# Altium project BW1098FFC.PrjPcb (part 2 of 2)

## Sheet BW1098FFC_USB.SchDoc: =project_title
size Tabloid; PageSetup: Record=PageOptions|CenterHorizontal=True|CenterVertical=True|PrintScale=0.73|XCorrection=1.00|YCorrection=1.00|PrintKind=0|BorderSize=5000000|LeftOffset=0|BottomOffset=0|Orientation=2|PaperLength=1000|PaperWidth=1000|Scale=100|PaperSource=7|PrintQuality=-4|MediaType=1|DitherType=10|PaperKind=A4|PrintScaleMode=1; CompanyName: Luxonis Holding; DrawnBy: Brian Weinstein; Organization: Luxonis Holding; Address1: 1925 Harmony Park Drive; Address2: Westminster, CO; Address3: 80234; Address4: United States; DocumentNumber: D0000190; Revision: R2M1E2; SheetNumber: 5; SheetTotal: 5
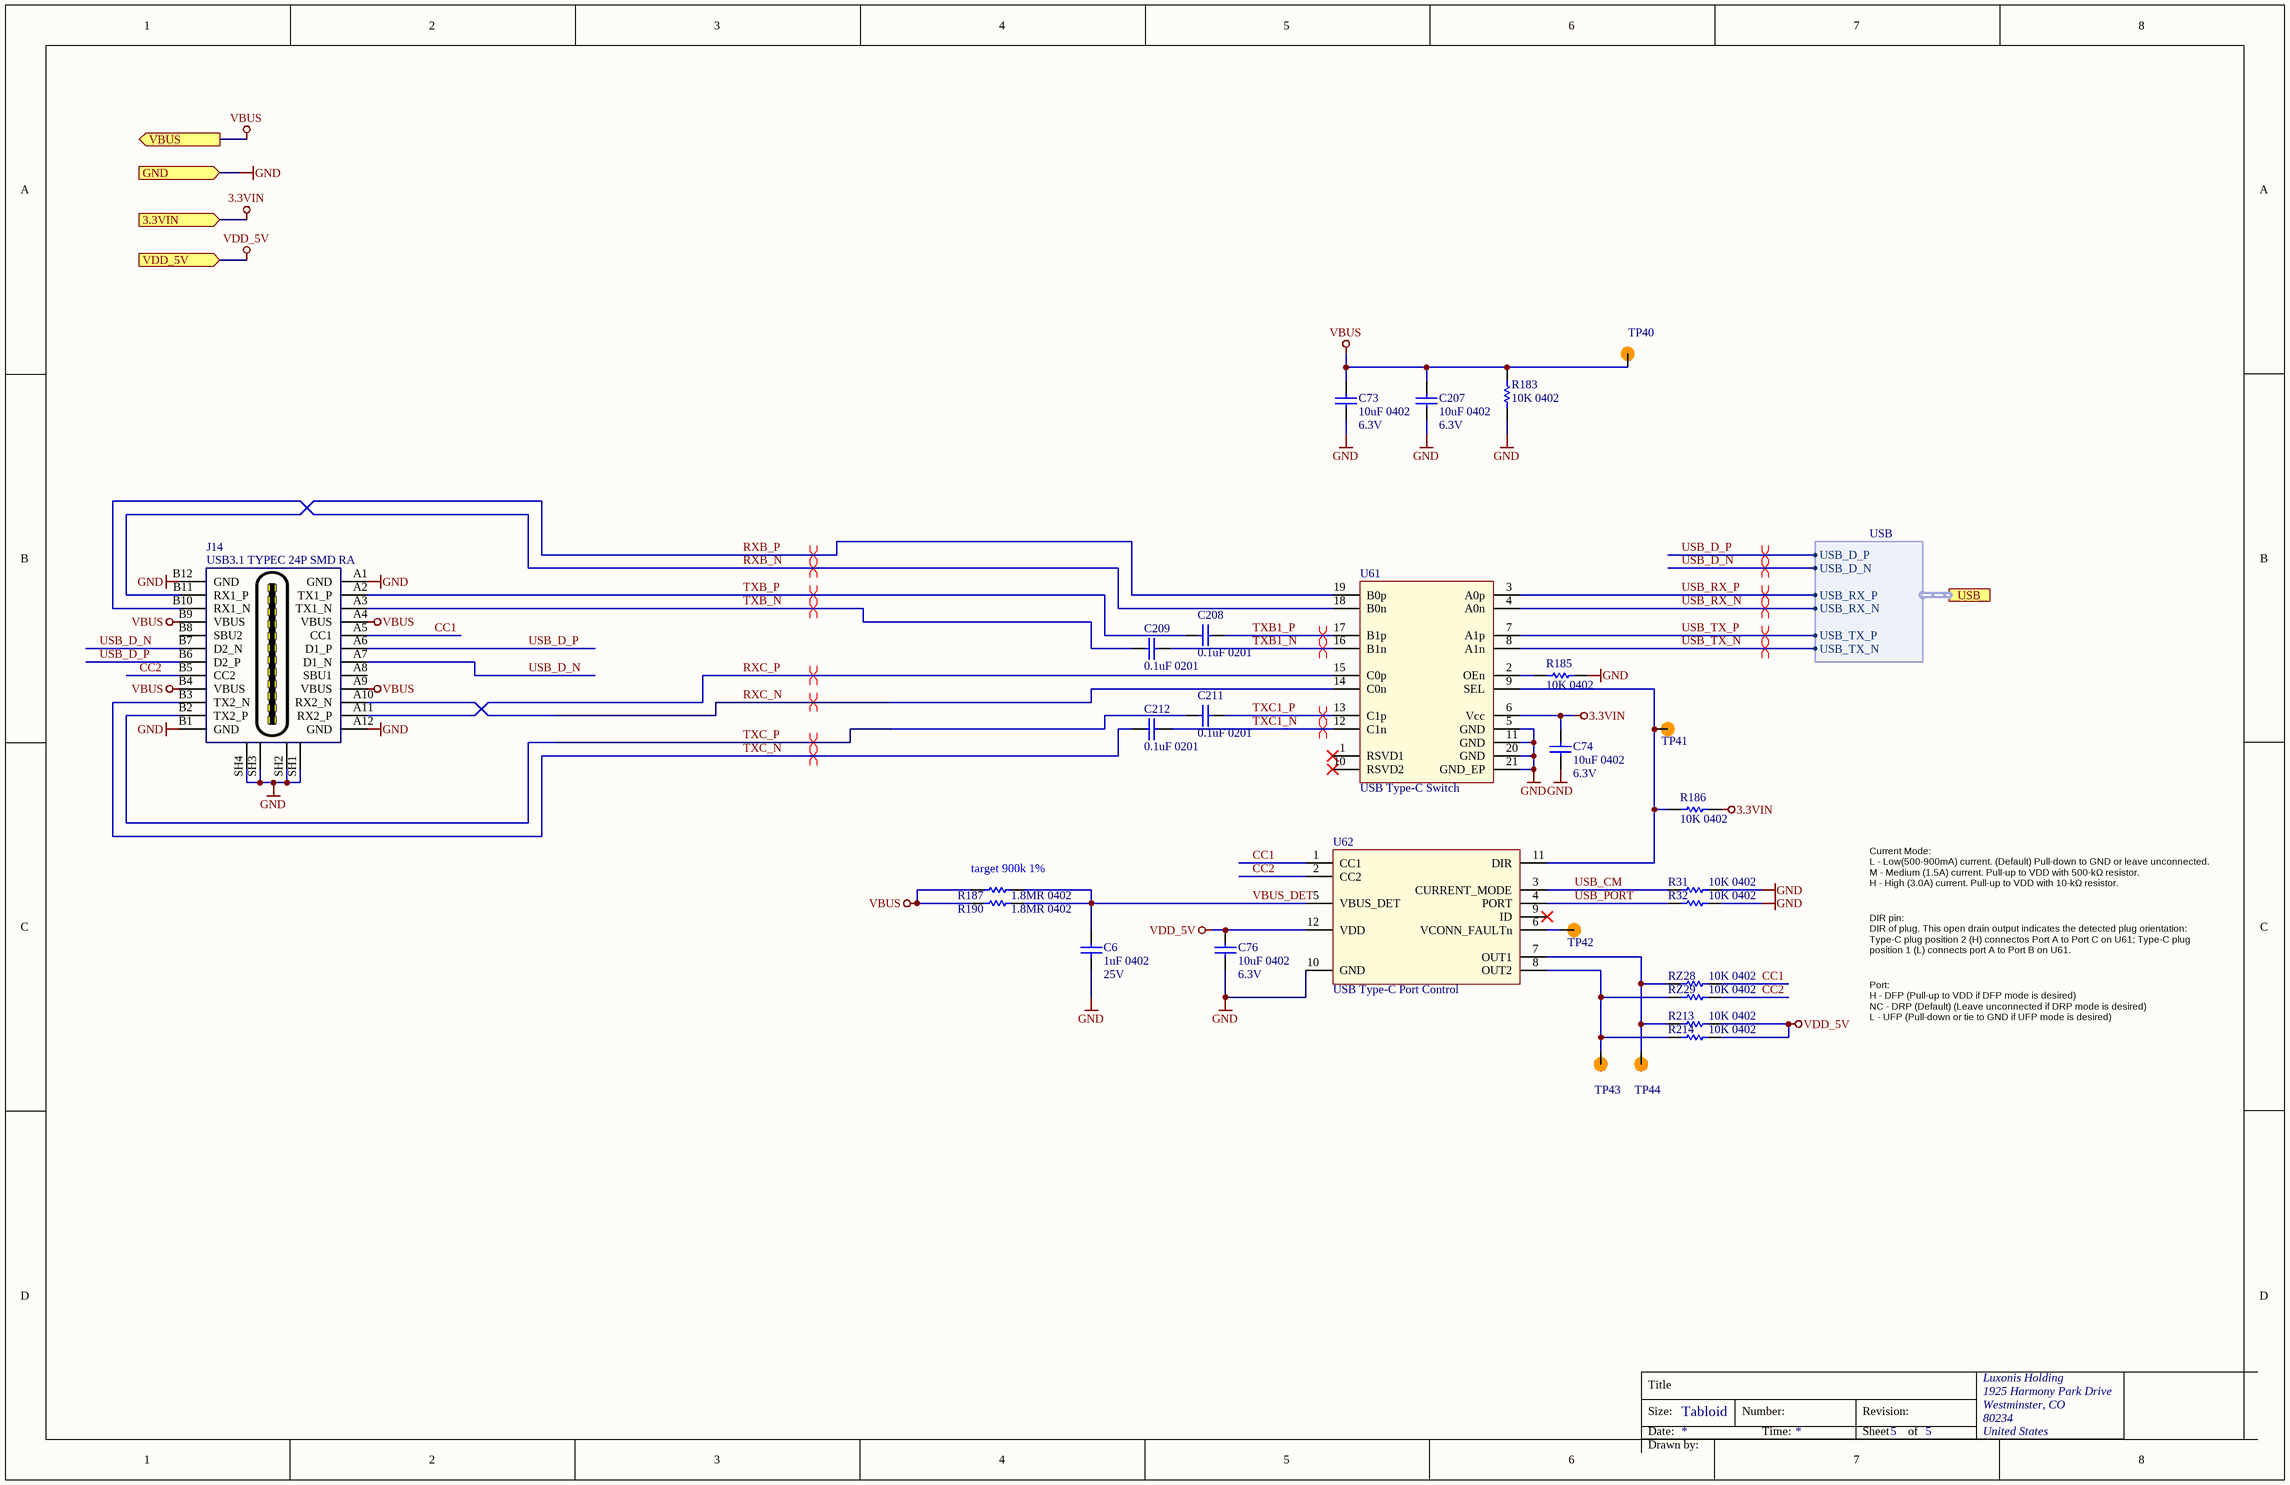
[diagram p2: BW1098FFC_USB.SchDoc]

### Parts
C6  1uF 0402  Voltage Rating: 25V  [CAPC0402(1005)70_N]
C73  10uF 0402  Voltage Rating: 6.3V  [CAPC0402(1005)70_N]
C74  10uF 0402  Voltage Rating: 6.3V  [CAPC0402(1005)70_N]
C76  10uF 0402  Voltage Rating: 6.3V  [CAPC0402(1005)70_N]
C207  10uF 0402  Voltage Rating: 6.3V  [CAPC0402(1005)70_N]
C208  0.1uF 0201  [CAPC0201(0603)33_L]
C209  0.1uF 0201  [CAPC0201(0603)33_L]
C211  0.1uF 0201  [CAPC0201(0603)33_L]
C212  0.1uF 0201  [CAPC0201(0603)33_L]
J14  USB3.1 TYPEC 24P SMD RA  [105450-0101]
R31  10K 0402  [RESC0402(1005)_N]
R32  10K 0402  [RESC0402(1005)_N]
R183  10K 0402  [RESC0402(1005)_N]
R185  10K 0402  [RESC0402(1005)_N]
R186  10K 0402  [RESC0402(1005)_N]
R187  1.8MR 0402  [RESC0402(1005)_N]
R190  1.8MR 0402  [RESC0402(1005)_N]
R213  10K 0402  [RESC0402(1005)_N]
R214  10K 0402  [RESC0402(1005)_N]
RZ28  10K 0402  [RESC0402(1005)_N]
RZ29  10K 0402  [RESC0402(1005)_N]
TP40  TP100_200_NS  [TP100_200_NS]  (value not drawn)  (no BOM)
TP41  TP100_200_NS  [TP100_200_NS]  (value not drawn)  (no BOM)
TP42  TP100_200_NS  [TP100_200_NS]  (value not drawn)  (no BOM)
TP43  TP100_200_NS  [TP100_200_NS]  (value not drawn)  (no BOM)
TP44  TP100_200_NS  [TP100_200_NS]  (value not drawn)  (no BOM)
U61  USB Type-C Switch  [HD3SS3212RKSR]
U62  USB Type-C Port Control  [TUSB321RWBR]

### Ports
3.3VIN (in), GND (in), USB (harness USB), VBUS (out), VDD_5V (in)

### Harnesses
USB: USB_D_P, USB_D_N, USB_TX_N, USB_TX_P, USB_RX_N, USB_RX_P

### Nets
3.3VIN: C74.2 R186.2 U61.6(Vcc) ; port 3.3VIN
GND: C6.1 C73.1 C74.1 C76.1 C207.1 J14.A1(GND) J14.A12(GND) J14.B1(GND) J14.B12(GND) J14.SH1(SH) J14.SH2(SH) J14.SH3(SH) J14.SH4(SH) R31.2 R32.2 R183.1 R185.2 U61.5(GND) U61.11(GND) U61.20(GND) U61.21(GND_EP) U62.10(GND) ; port GND
VBUS: C73.2 C207.2 J14.A4(VBUS) J14.A9(VBUS) J14.B4(VBUS) J14.B9(VBUS) R183.2 R187.1 R190.1 TP40.1 ; port VBUS
VDD_5V: C76.2 R213.2 R214.2 U62.12(VDD) ; port VDD_5V
CC1: J14.A5(CC1) RZ28.2 U62.1(CC1)
CC2: J14.B5(CC2) RZ29.2 U62.2(CC2)
RXB_N: J14.B10(RX1_N) U61.18(B0n)
RXB_P: J14.B11(RX1_P) U61.19(B0p)
RXC_N: J14.A10(RX2_N) U61.14(C0n)
RXC_P: J14.A11(RX2_P) U61.15(C0p)
TXB1_N: C209.2 U61.16(B1n)
TXB1_P: C208.2 U61.17(B1p)
TXB_N: C209.1 J14.A3(TX1_N)
TXB_P: C208.1 J14.A2(TX1_P)
TXC1_N: C212.2 U61.12(C1n)
TXC1_P: C211.2 U61.13(C1p)
TXC_N: C212.1 J14.B3(TX2_N)
TXC_P: C211.1 J14.B2(TX2_P)
USB_CM: R31.1 U62.3(CURRENT_MODE)
USB_D_N: J14.A7(D1_N) J14.B7(D2_N) ; port USB.USB_D_N
USB_D_P: J14.A6(D1_P) J14.B6(D2_P) ; port USB.USB_D_P
USB_PORT: R32.1 U62.4(PORT)
USB_RX_N: U61.4(A0n) ; port USB.USB_RX_N
USB_RX_P: U61.3(A0p) ; port USB.USB_RX_P
USB_TX_N: U61.8(A1n) ; port USB.USB_TX_N
USB_TX_P: U61.7(A1p) ; port USB.USB_TX_P
VBUS_DET: C6.2 R187.2 R190.2 U62.5(VBUS_DET)
NetR185_1: R185.1 U61.2(OEn)
NetR186_1: R186.1 TP41.1 U61.9(SEL) U62.11(DIR)
NetR213_1: R213.1 RZ28.1 TP44.1 U62.7(OUT1)
NetR214_1: R214.1 RZ29.1 TP43.1 U62.8(OUT2)
NetTP42_1: TP42.1 U62.6(VCONN_FAULTn)

Not connected (* = marked no-connect by the designer): J14 A8(SBU1) B8(SBU2); U61 1(RSVD1)* 10(RSVD2)*; U62 9(ID)*

### Layout directives
differential pair; differential pair class USB3: RXB_N, RXB_P, RXC_N, RXC_P, TXB1_N, TXB1_P, TXB_N, TXB_P, TXC1_N, TXC1_P, TXC_N, TXC_P, USB_D_N, USB_D_P, USB_RX_N, USB_RX_P, USB_TX_N, USB_TX_P

### Notes on the sheet
- (near R187) target 900k 1%
- Current Mode:
  L - Low(500-900mA) current. (Default) Pull-down to GND or leave unconnected.
  M - Medium (1.5A) current. Pull-up to VDD with 500-kΩ resistor.
  H - High (3.0A) current. Pull-up to VDD with 10-kΩ resistor.
- DIR pin:
  DIR of plug. This open drain output indicates the detected plug orientation: Type-C plug position 2 (H) connectos Port A to Port C on U61; Type-C plug position 1 (L) connects port A to Port B on U61.
- Port:
  H - DFP (Pull-up to VDD if DFP mode is desired)
  NC - DRP (Default) (Leave unconnected if DRP mode is desired)
  L - UFP (Pull-down or tie to GND if UFP mode is desired)
- Title
- Size:
- Date:
- Tabloid
- Number:
- Time:
- Revision:
- Sheet
- of
- Drawn by:

### Library data of the parts
C6 = GRM155R61E105KA12D: CAP CER 1UF 25V X5R 0402 10%; Manufacturer 1: Murata; Material: Ceramic; Supplier 1: Digi-Key; Manufacturer Part Number 1: GRM155R61E105KA12D; Stock 1: 200653; Pricing 1: 1=0.10000, 10=0.07100, 100=0.03350, 500=0.02352, 1000=0.01947, 2500=0.01812, 5000=0.01658 (USD); RoHS: Yes; Mount: Surface Mount; Case/Package: 0402; Weight: 0.000212oz; Case Code (Metric): 1005; Case Code (Imperial): 0402; Min Operating Temperature: -55°C; Max Operating Temperature: 85°C; Tolerance: 10%; Capacitance: 1uF; Dielectric: X5R; Voltage Rating (DC): 25V; Packaging: Tape and Reel; Package Quantity: 10000; Termination: SMD/SMT; Voltage: 25V; Length: 1mm; Height: 0.5mm; Width: 0.5mm; Thickness: 0.022inch; Depth: 0.5mm; Lead Free: Lead Free; REACH SVHC: No SVHC; ComponentLink1URL: https://datasheet.ciiva.com/22732/1666664-22732122.pdf?src-supplier=Element14; ComponentLink1Description: https://datasheet.ciiva.com/22732/1666664-22732122.pdf?src-supplier=Element14; ComponentLink2URL: https://datasheet.ciiva.com/7719/1666664-7719006.pdf?src-supplier=Element14; ComponentLink2Description: https://datasheet.ciiva.com/7719/1666664-7719006.pdf?src-supplier=Element14; Supplier Part Number 1: 490-10017-1-ND; Supplier 2: Arrow; Supplier 3: TTI; Supplier Part Number 2: GRM155R61E105KA12D; Supplier Part Number 3: GRM155R61E105KA12D
C73 C74 C76 C207 = GRM155R60J106ME15D: CAP CER 10UF 6.3V X5R 0402 20%; Manufacturer 1: Murata; Supplier 1: Digi-Key; Manufacturer Part Number 1: GRM155R60J106ME15D; Stock 1: 1839627; Pricing 1: 1=0.23000, 10=0.15700, 100=0.07950, 500=0.05442, 1000=0.04814, 2500=0.04605, 5000=0.04186 (USD); RoHS: Yes; Mount: Surface Mount; Case/Package: 0402; Case Code (Metric): 1005; Case Code (Imperial): 0402; Min Operating Temperature: -55°C; Max Operating Temperature: 85°C; Packaging: Tape and Reel; Capacitance: 10uF; Dielectric: X5R; Length: 0.039inch; Width: 0.02inch; ComponentLink1URL: https://www.murata.com/~/media/webrenewal/support/library/catalog/products/capacitor/mlcc/c02e.ashx?la=en-us&src-supplier=Digi-Key; ComponentLink1Description: https://www.murata.com/~/media/webrenewal/support/library/catalog/products/capacitor/mlcc/c02e.ashx?la=en-us&src-supplier=Digi-Key; Supplier Part Number 1: 490-13238-1-ND; Voltage Rating (DC): 6.3V; Thickness: 0.026inch; Tolerance: 20%
C208 C209 C211 C212 = GRM033R61A104KE15D: CAP CER 0.1UF 10V X5R 0201; Manufacturer 1: Murata; Capacitance: 100nF; Tolerance: 10%; Supplier 1: Digi-Key; Manufacturer Part Number 1: GRM033R61A104KE15D; Stock 1: 45335312; Pricing 1: 1=0.10000, 10=0.04200, 100=0.01860, 500=0.01330, 1000=0.01045, 2500=0.00950, 5000=0.00874 (USD); RoHS: Yes; Mount: Surface Mount; Case/Package: 0201; Weight: 6E-06oz; Case Code (Metric): 0603; Case Code (Imperial): 0201; Min Operating Temperature: -55°C; Max Operating Temperature: 85°C; Packaging: Tape and Reel; Voltage Rating: 10V; Package Quantity: 1; Voltage Rating (DC): 10V; Dielectric: X5R; Termination: SMD/SMT; Length: 0.6mm; Height: 0.3mm; Width: 0.012inch; Thickness: 0.013inch; Depth: 0.3mm; Radiation Hardening: No; Lead Free: Lead Free; REACH SVHC: No SVHC; ComponentLink1URL: https://datasheet.ciiva.com/26843/getdatasheetpartid-308656-26843739.pdf?src-supplier=Verical; ComponentLink1Description: https://datasheet.ciiva.com/26843/getdatasheetpartid-308656-26843739.pdf?src-supplier=Verical; ComponentLink2URL: https://datasheet.ciiva.com/5413/product-5413117.pdf?src-supplier=Mouser; ComponentLink2Description: https://datasheet.ciiva.com/5413/product-5413117.pdf?src-supplier=Mouser; ComponentLink3URL: https://datasheet.ciiva.com/6256/partnumbering-e-01-6256406.pdf?src-supplier=Digi-Key; ComponentLink3Description: https://datasheet.ciiva.com/6256/partnumbering-e-01-6256406.pdf?src-supplier=Digi-Key; ComponentLink4URL: https://datasheet.ciiva.com/6256/partnumbering-e-01-6256407.pdf?src-supplier=Digi-Key; ComponentLink4Description: https://datasheet.ciiva.com/6256/partnumbering-e-01-6256407.pdf?src-supplier=Digi-Key; ComponentLink5URL: https://datasheet.ciiva.com/6256/partnumbering-e-01-6256408.pdf?src-supplier=Digi-Key; ComponentLink5Description: https://datasheet.ciiva.com/6256/partnumbering-e-01-6256408.pdf?src-supplier=Digi-Key; Supplier Part Number 1: 490-5881-1-ND; Voltage: 10V
J14 = 105450-0101: CONN RCP USB3.1 TYPEC 24P SMD RA; Manufacturer 1: Molex; Connector Type: USB; Number of Contacts: 24; Gender: Receptacle; Number of Ports: 1; Current Rating: 5A; Mating Cycles: 10000; Shielding: Shielded; Pitch: 0.5mm; Supplier 1: Digi-Key; Manufacturer Part Number 1: 105450-0101; Stock 1: 13882; Pricing 1: 1=2.15000, 10=1.94900, 25=1.82960, 50=1.75000, 100=1.67050, 250=1.51140, 500=1.39208 (USD); RoHS: Yes; Mount: Surface Mount,Through Hole,Horizontal; Case/Package: 0101; Number of Pins: 24; Contact Material: Copper Alloy; Contact Plating: Gold; Number of Terminals: 24; Housing Material: Thermoplastic; Insulation Color: Black; Min Operating Temperature: -30°C; Max Operating Temperature: 85°C; Packaging: Tape and Reel; Orientation: Right Angle; Termination: Solder; USB Standard: USB 3.1; Features: Shielded; Length: 8.94mm; REACH SVHC: Unknown; Flammability Rating: UL94 V-0; ComponentLink1URL: http://www.farnell.com/datasheets/2673427.pdf?src-supplier=Farnell; ComponentLink1Description: http://www.farnell.com/datasheets/2673427.pdf?src-supplier=Farnell; ComponentLink2URL: http://www.farnell.com/datasheets/2801634.pdf?src-supplier=Farnell; ComponentLink2Description: http://www.farnell.com/datasheets/2801634.pdf?src-supplier=Farnell; ComponentLink3URL: http://www.farnell.com/datasheets/2672741.pdf?src-supplier=Newark; ComponentLink3Description: http://www.farnell.com/datasheets/2672741.pdf?src-supplier=Newark; ComponentLink4URL: https://www.molex.com/pdm_docs/sd/1054500101_sd.pdf?src-supplier=Digi-Key; ComponentLink4Description: https://www.molex.com/pdm_docs/sd/1054500101_sd.pdf?src-supplier=Digi-Key; ComponentLink5URL: https://www.molex.com/pdm_docs/ps/PS-105448-001.pdf?src-supplier=Digi-Key; ComponentLink5Description: https://www.molex.com/pdm_docs/ps/PS-105448-001.pdf?src-supplier=Digi-Key; ComponentLink6URL: http://www.farnell.com/datasheets/2015275.pdf?src-supplier=Element14; ComponentLink6Description: http://www.farnell.com/datasheets/2015275.pdf?src-supplier=Element14; ComponentLink7URL: http://www.literature.molex.com/SQLImages/kelmscott/Molex/PDF_Images/987651-4081.PDF?src-supplier=Avnet; ComponentLink7Description: http://www.literature.molex.com/SQLImages/kelmscott/Molex/PDF_Images/987651-4081.PDF?src-supplier=Avnet; ComponentLink8URL: http://www.literature.molex.com/SQLImages/kelmscott/Molex/PDF_Images/987651-4081.PDF?src-supplier=Avnet+Asia; ComponentLink8Description: http://www.literature.molex.com/SQLImages/kelmscott/Molex/PDF_Images/987651-4081.PDF?src-supplier=Avnet+Asia; Supplier Part Number 1: WM12856CT-ND
R31 R32 R183 R185 R186 R213 R214 RZ28 RZ29 = RC0402FR-1310KL: RES SMD 10K OHM 1% 0402 1/16W Chip Resistor, 0402 [1005 Metric], 10 kohm, RC Series, 50 V, Thick Film, 62.5 mW; Manufacturer 1: Yageo; Resistance: 10kR; Temperature Coefficient: 100ppm/°C; Power Rating: 62.5mW; Voltage Rating: 50V; ComponentLink1URL: https://datasheet.ciiva.com/16940/pyu-rc0402-51-rohs-l-6-16940293.pdf?src-supplier=Avnet+Europe; ComponentLink1Description: https://datasheet.ciiva.com/16940/pyu-rc0402-51-rohs-l-6-16940293.pdf?src-supplier=Avnet+Europe; ComponentLink2URL: https://datasheet.ciiva.com/28386/pyu-rc0402-51-rohs-l-6-28386855.pdf?src-supplier=Avnet+Europe; ComponentLink2Description: https://datasheet.ciiva.com/28386/pyu-rc0402-51-rohs-l-6-28386855.pdf?src-supplier=Avnet+Europe; ComponentLink3URL: https://datasheet.ciiva.com/16740/pyu-rc0402-51-rohs-l-6-r-16740602.pdf?src-supplier=Future+Electronics; ComponentLink3Description: https://datasheet.ciiva.com/16740/pyu-rc0402-51-rohs-l-6-r-16740602.pdf?src-supplier=Future+Electronics; ComponentLink4URL: https://datasheet.ciiva.com/8891/pyu-rc0402-51-rohs-l-6-8891339.pdf?src-supplier=Avnet; ComponentLink4Description: https://datasheet.ciiva.com/8891/pyu-rc0402-51-rohs-l-6-8891339.pdf?src-supplier=Avnet; ComponentLink5URL: https://datasheet.ciiva.com/5557/pyu-rc0402-51-rohs-l-6-r-5557997.pdf?src-supplier=Mouser; ComponentLink5Description: https://datasheet.ciiva.com/5557/pyu-rc0402-51-rohs-l-6-r-5557997.pdf?src-supplier=Mouser; ComponentLink6URL: https://datasheet.ciiva.com/7983/1018594-7983533.pdf?src-supplier=Element14; ComponentLink6Description: https://datasheet.ciiva.com/7983/1018594-7983533.pdf?src-supplier=Element14; Supplier 1: Newark; Manufacturer Part Number 1: RC0402FR-1310KL; Stock 1: 62239; Pricing 1: 1=0.10000, 25=0.01200, 100=0.00400, 250=0.00400, 500=0.00300, 1000=0.00300 (USD); RoHS: Yes; Case/Package: 0402; Number of Pins: 2; Contact Plating: Tin,Matte,Lead; Case Code (Imperial): 0402; Case Code (Metric): 1005; Min Operating Temperature: -55°C; Max Operating Temperature: 155°C; Tolerance: 1%; Composition: Thick Film; Packaging: Tape and Reel; Termination: SMD/SMT; Military Standard: Not; Voltage Rating (DC): 50V; Working Voltage: 50V; Number of Terminations: 2; Length: 1mm; Depth: 0.5mm; Radiation Hardening: No; REACH SVHC: No SVHC; Lead Free: Lead Free; Supplier Part Number 1: 67R9960
R187 R190 = CRCW04021M80FKED: RES SMD 1.8M OHM 1% 1/16W 0402; Manufacturer 1: Vishay; Voltage Rating: 50V; Temperature Coefficient: 100ppm/°C; Power Rating: 63mW; Supplier 1: Digi-Key; Manufacturer Part Number 1: CRCW04021M80FKED; Stock 1: 26061; Pricing 1: 1=0.10000, 10=0.03800, 100=0.01540, 1000=0.00690, 2500=0.00599, 5000=0.00495 (USD); RoHS: Yes; Mount: Surface Mount; Case/Package: 0402; Number of Pins: 2; Weight: 2.3E-05oz; Case Code (Imperial): 0402; Case Code (Metric): 1005; Contact Plating: Tin; Min Operating Temperature: -55°C; Max Operating Temperature: 155°C; Packaging: Tape and Reel; Package Quantity: 10000; Termination: SMD/SMT; Voltage Rating (DC): 50V; Composition: Thick Film; Tolerance: 1%; Military Standard: Not; Resistance: 1.8MR; Length: 1mm; Height: 0.35mm; Width: 0.5mm; Depth: 0.5mm; Radiation Hardening: No; Lead Free: Lead Free; REACH SVHC: Unknown; ComponentLink1URL: https://datasheet.ciiva.com/11812/0900766b80d98824-11812579.pdf?src-supplier=RSComponents; ComponentLink1Description: https://datasheet.ciiva.com/11812/0900766b80d98824-11812579.pdf?src-supplier=RSComponents; ComponentLink2URL: https://datasheet.ciiva.com/16886/dcrcwe3-16886536.pdf?src-supplier=Avnet+Europe; ComponentLink2Description: https://datasheet.ciiva.com/16886/dcrcwe3-16886536.pdf?src-supplier=Avnet+Europe; ComponentLink3URL: https://datasheet.ciiva.com/7800/1697337-7800987.pdf?src-supplier=Element14; ComponentLink3Description: https://datasheet.ciiva.com/7800/1697337-7800987.pdf?src-supplier=Element14; ComponentLink4URL: https://datasheet.ciiva.com/16786/70201119-16786875.pdf?src-supplier=Allied+Electronics; ComponentLink4Description: https://datasheet.ciiva.com/16786/70201119-16786875.pdf?src-supplier=Allied+Electronics; ComponentLink5URL: https://datasheet.ciiva.com/22676/1700796-22676027.pdf?src-supplier=Element14; ComponentLink5Description: https://datasheet.ciiva.com/22676/1700796-22676027.pdf?src-supplier=Element14; ComponentLink6URL: https://datasheet.ciiva.com/7800/1697337-7800988.pdf?src-supplier=Element14; ComponentLink6Description: https://datasheet.ciiva.com/7800/1697337-7800988.pdf?src-supplier=Element14; ComponentLink7URL: https://datasheet.ciiva.com/26316/fld-crcw-e3-data-en-26316605.pdf?src-supplier=Distrelec; ComponentLink7Description: https://datasheet.ciiva.com/26316/fld-crcw-e3-data-en-26316605.pdf?src-supplier=Distrelec; ComponentLink8URL: https://datasheet.ciiva.com/8336/dcrcwe3-8336646.pdf?src-supplier=Avnet; ComponentLink8Description: https://datasheet.ciiva.com/8336/dcrcwe3-8336646.pdf?src-supplier=Avnet; Supplier Part Number 1: 541-1.80MLCT-ND
TP40-TP44 = TEST_POINT
U61 = HD3SS3212RKSR: IC MUX 2:1 8 OHM 20VQFN; Manufacturer 1: Texas Instruments; Bandwidth: 8GHz; Min Supply Voltage: 3V; Max Supply Voltage: 3.6V; Data Rate: 480Mbps; Number of Ports: 3; USB Standard: USB 3.1; Supplier 1: Digi-Key; Manufacturer Part Number 1: HD3SS3212RKSR; Stock 1: 36674; Pricing 1: 1=1.79000, 10=1.61000, 100=1.29440, 500=1.06348, 1000=0.88117 (USD); RoHS: Yes; Mount: Standard; Case/Package: VQFN; Number of Pins: 20; Min Operating Temperature: 0°C; Max Operating Temperature: 70°C; Packaging: Tape and Reel; Lead Free: Lead Free; REACH SVHC: No SVHC; ComponentLink1URL: http://www.ti.com/general/docs/lit/getliterature.tsp?genericPartNumber=HD3SS3212&&fileType=pdf&src-supplier=Avnet; ComponentLink1Description: http://www.ti.com/general/docs/lit/getliterature.tsp?genericPartNumber=HD3SS3212&&fileType=pdf&src-supplier=Avnet; ComponentLink2URL: http://www.ti.com/general/docs/lit/getliterature.tsp?genericPartNumber=HD3SS3212&amp;&amp;fileType=pdf&src-supplier=Farnell; ComponentLink2Description: http://www.ti.com/general/docs/lit/getliterature.tsp?genericPartNumber=HD3SS3212&amp;&amp;fileType=pdf&src-supplier=Farnell; ComponentLink3URL: http://www.ti.com/lit/ds/symlink/hd3ss3212.pdf?src-supplier=Digi-Key; ComponentLink3Description: http://www.ti.com/lit/ds/symlink/hd3ss3212.pdf?src-supplier=Digi-Key; ComponentLink4URL: http://www.ti.com/lit/gpn/hd3ss3212?src-supplier=Mouser; ComponentLink4Description: http://www.ti.com/lit/gpn/hd3ss3212?src-supplier=Mouser; ComponentLink5URL: http://www.ti.com/general/docs/lit/getliterature.tsp?genericPartNumber=HD3SS3212&&fileType=pdf&src-supplier=Element14; ComponentLink5Description: http://www.ti.com/general/docs/lit/getliterature.tsp?genericPartNumber=HD3SS3212&&fileType=pdf&src-supplier=Element14; Supplier Part Number 1: 296-42174-1-ND
U62 = TUSB321RWBR: IC USB PORT CONTROL TYPE-C 12X2Q; Manufacturer 1: Texas Instruments; Min Supply Voltage: 4.5V; Max Supply Voltage: 5.5V; Number of Ports: 1; USB Standard: USB 3.1; Supplier 1: Digi-Key; Manufacturer Part Number 1: TUSB321RWBR; Stock 1: 7746; Pricing 1: 1=2.27000, 10=2.04200, 100=1.64100, 500=1.34828, 1000=1.11714 (USD); RoHS: Yes; Mount: Surface Mount; Number of Pins: 12; Contact Plating: Gold; Min Operating Temperature: 0°C; Max Operating Temperature: 70°C; Packaging: Tape and Reel; REACH SVHC: No SVHC; Lead Free: Lead Free; ComponentLink1URL: http://www.ti.com/general/docs/lit/getliterature.tsp?genericPartNumber=TUSB321&&fileType=pdf&src-supplier=Avnet+Asia; ComponentLink1Description: http://www.ti.com/general/docs/lit/getliterature.tsp?genericPartNumber=TUSB321&&fileType=pdf&src-supplier=Avnet+Asia; ComponentLink2URL: http://www.ti.com/general/docs/lit/getliterature.tsp?genericPartNumber=TUSB321&&fileType=pdf&src-supplier=Farnell; ComponentLink2Description: http://www.ti.com/general/docs/lit/getliterature.tsp?genericPartNumber=TUSB321&&fileType=pdf&src-supplier=Farnell; ComponentLink3URL: http://www.ti.com/lit/ds/symlink/tusb321.pdf?src-supplier=Digi-Key; ComponentLink3Description: http://www.ti.com/lit/ds/symlink/tusb321.pdf?src-supplier=Digi-Key; ComponentLink4URL: http://www.ti.com/general/docs/lit/getliterature.tsp?genericPartNumber=TUSB321&&fileType=pdf&src-supplier=Element14; ComponentLink4Description: http://www.ti.com/general/docs/lit/getliterature.tsp?genericPartNumber=TUSB321&&fileType=pdf&src-supplier=Element14; ComponentLink5URL: http://www.ti.com/general/docs/lit/getliterature.tsp?genericPartNumber=TUSB321&&fileType=pdf&src-supplier=Avnet; ComponentLink5Description: http://www.ti.com/general/docs/lit/getliterature.tsp?genericPartNumber=TUSB321&&fileType=pdf&src-supplier=Avnet; Supplier Part Number 1: 296-42400-1-ND

## Sheet BW1098FFC_MIPI_CAM.SchDoc: =project_title
size Tabloid; PageSetup: Record=PageOptions|CenterHorizontal=True|CenterVertical=True|PrintScale=0.73|XCorrection=1.00|YCorrection=1.00|PrintKind=0|BorderSize=5000000|LeftOffset=0|BottomOffset=0|Orientation=2|PaperLength=1000|PaperWidth=1000|Scale=100|PaperSource=7|PrintQuality=-4|MediaType=1|DitherType=10|PaperKind=A4|PrintScaleMode=1; CompanyName: Luxonis Holding; DrawnBy: Brian Weinstein; Organization: Luxonis Holding; Address1: 1925 Harmony Park Drive; Address2: Westminster, CO; Address3: 80234; Address4: United States; DocumentNumber: D0000190; Revision: R2M1E2; SheetNumber: 4; SheetTotal: 5
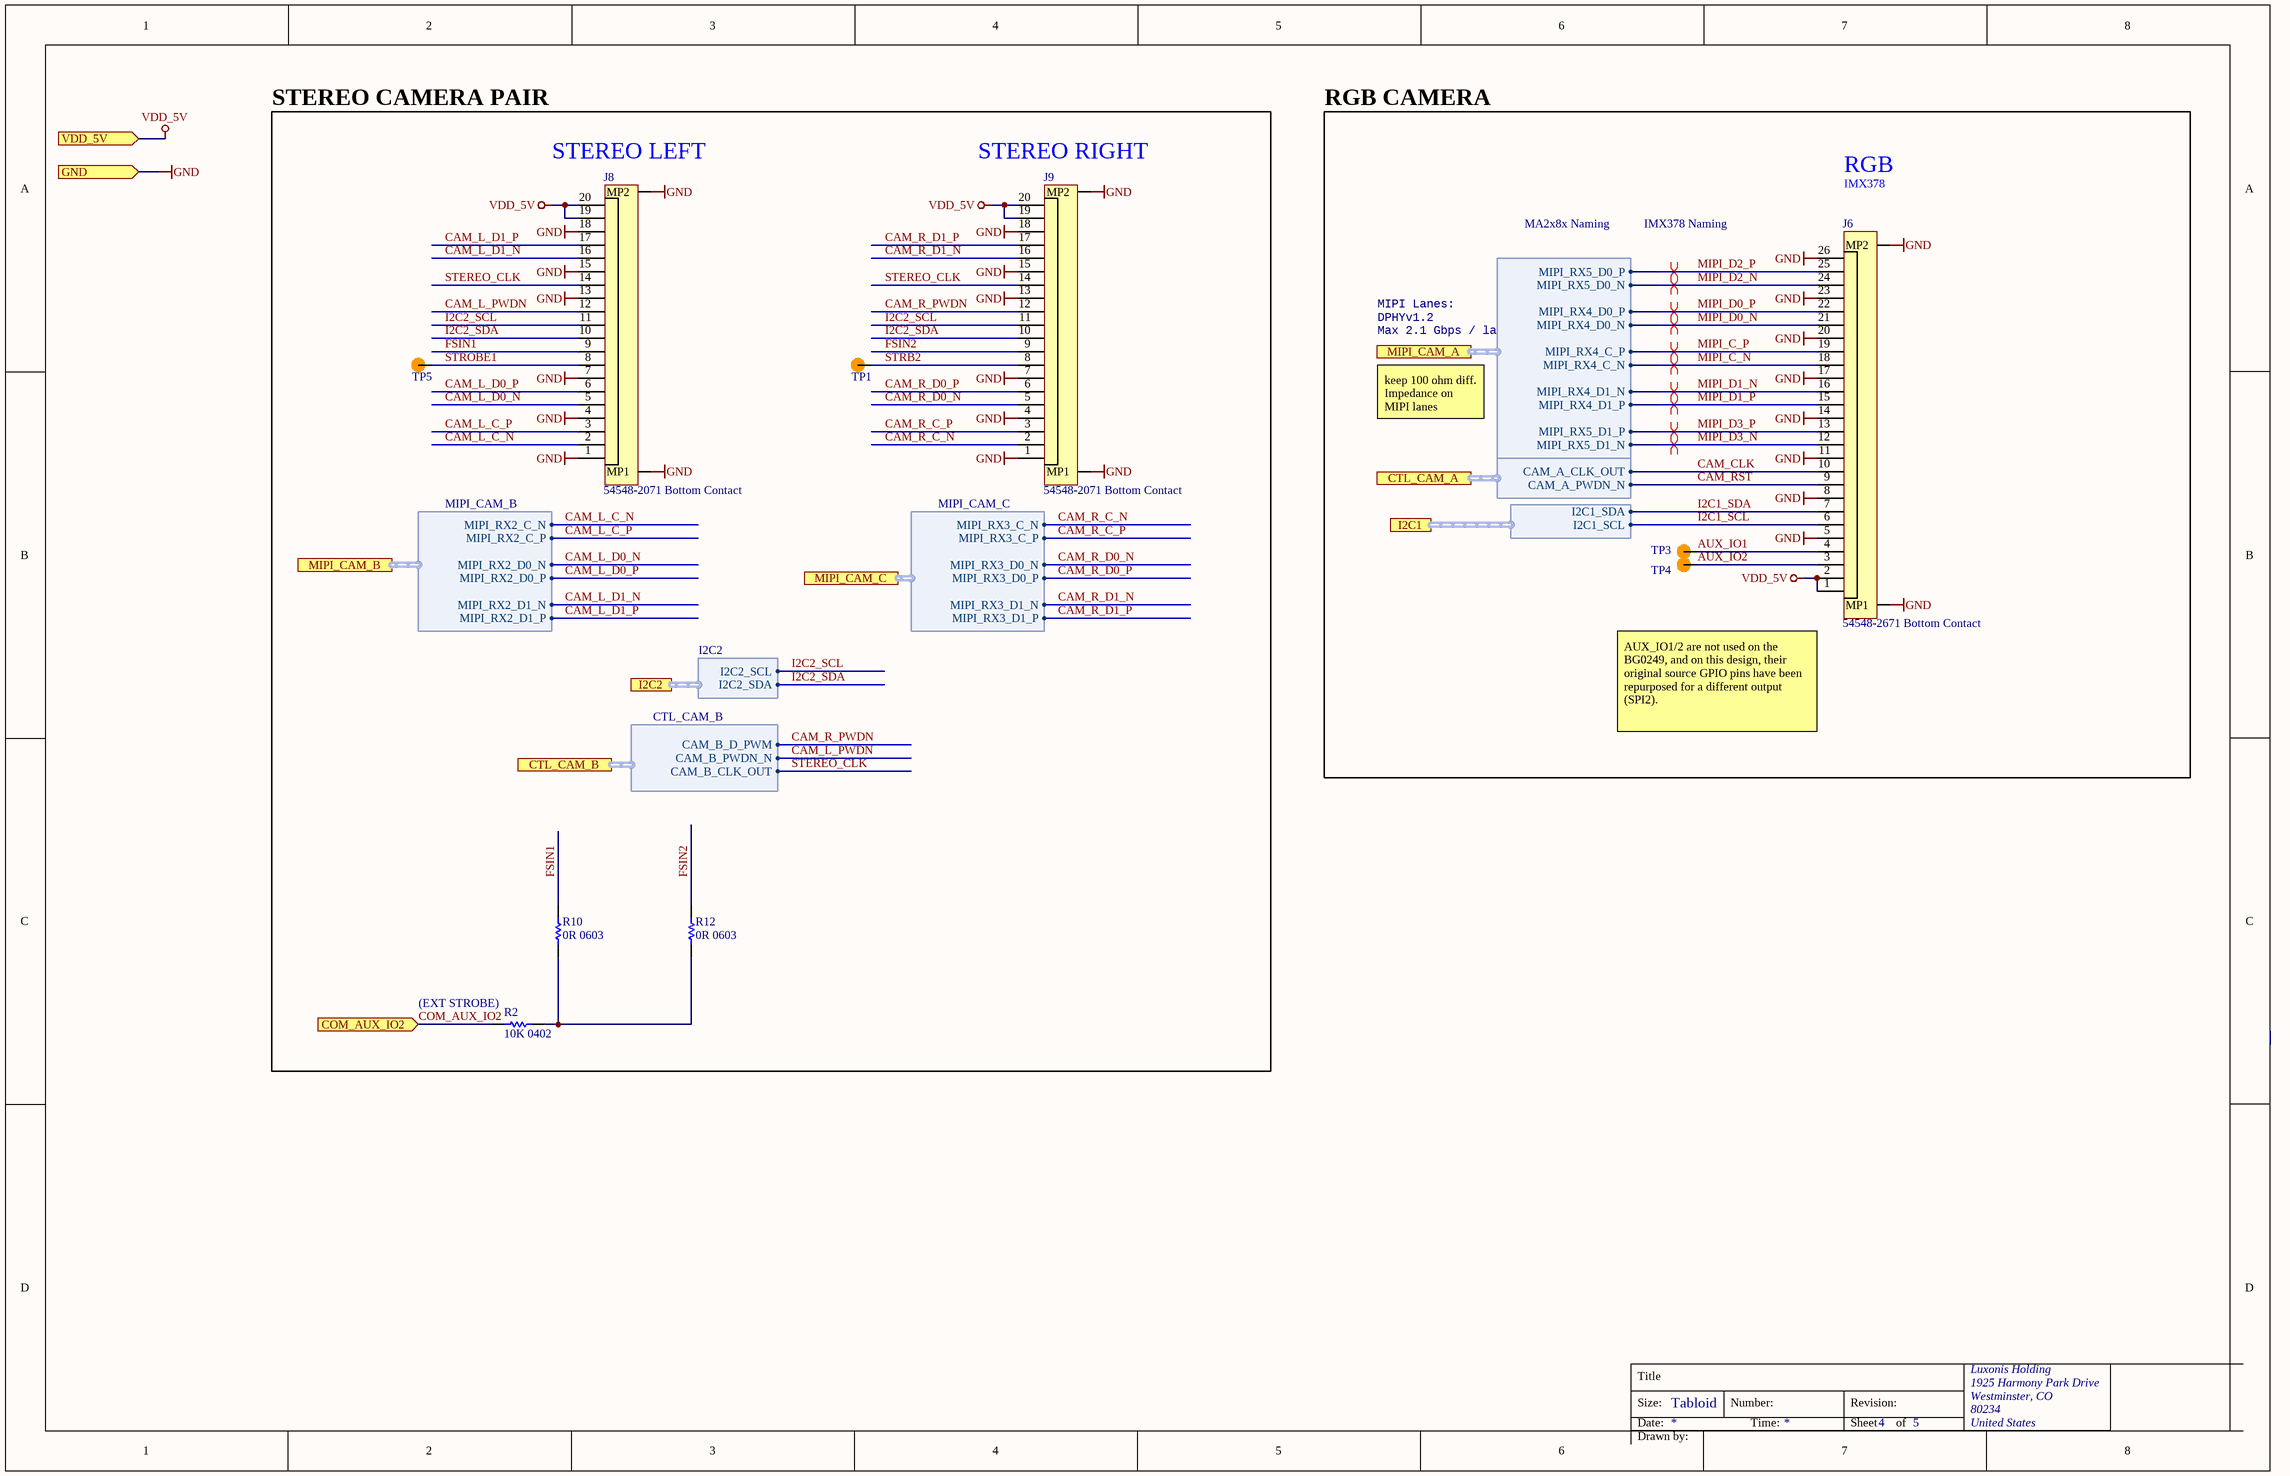
[diagram p3: BW1098FFC_MIPI_CAM.SchDoc]

### Parts
J6  54548-2671 Bottom Contact  [54548-2671]
J8  54548-2071 Bottom Contact  [54548-2071]
J9  54548-2071 Bottom Contact  [54548-2071]
R2  10K 0402  [RESC0402(1005)_N]
R10  0R 0603  [RESC0603(1608)_N]
R12  0R 0603  [RESC0603(1608)_N]
TP1  TP100_200_NS  [TP100_200_NS]  (value not drawn)  (no BOM)
TP3  TP100_200_NS  [TP100_200_NS]  (value not drawn)  (no BOM)
TP4  TP100_200_NS  [TP100_200_NS]  (value not drawn)  (no BOM)
TP5  TP100_200_NS  [TP100_200_NS]  (value not drawn)  (no BOM)

### Ports
COM_AUX_IO2 (in), CTL_CAM_A (harness CTL_CAM_A), CTL_CAM_B (harness CTL_CAM_B), GND (in), I2C1 (harness I2C1), I2C2 (harness I2C2), MIPI_CAM_A (harness MIPI_CAM_A), MIPI_CAM_B (harness MIPI_CAM_B), MIPI_CAM_C (harness MIPI_CAM_C), VDD_5V (in)

### Harnesses
MIPI_CAM_B: MIPI_RX2_C_P, MIPI_RX2_C_N, MIPI_RX2_D0_P, MIPI_RX2_D0_N, MIPI_RX2_D1_P, MIPI_RX2_D1_N
I2C2: I2C2_SDA, I2C2_SCL
I2C1: I2C1_SDA, I2C1_SCL
MIPI_CAM_A: MIPI_RX5_D0_P, MIPI_RX5_D0_N, MIPI_RX4_D0_P, MIPI_RX4_D0_N, MIPI_RX4_C_P, MIPI_RX4_C_N, MIPI_RX4_D1_N, MIPI_RX4_D1_P, MIPI_RX5_D1_P, MIPI_RX5_D1_N
MIPI_CAM_C: MIPI_RX3_C_P, MIPI_RX3_C_N, MIPI_RX3_D0_P, MIPI_RX3_D0_N, MIPI_RX3_D1_P, MIPI_RX3_D1_N
CTL_CAM_A: CAM_A_PWDN_N, CAM_A_CLK_OUT
CTL_CAM_B: CAM_B_CLK_OUT, CAM_B_PWDN_N, CAM_B_D_PWM

### Nets
GND: J6.5 J6.8 J6.11 J6.14 J6.17 J6.20 J6.23 J6.26 J6.MP1 J6.MP2 J8.1 J8.4 J8.7 J8.13 J8.15 J8.18 J8.MP1 J8.MP2 J9.1 J9.4 J9.7 J9.13 J9.15 J9.18 J9.MP1 J9.MP2 ; port GND
VDD_5V: J6.1 J6.2 J8.19 J8.20 J9.19 J9.20 ; port VDD_5V
AUX_IO1: J6.4 TP3.1
AUX_IO2: J6.3 TP4.1
CAM_CLK: J6.10 ; port CTL_CAM_A.CAM_A_CLK_OUT  [project net CAM_A_CLK_OUT]
CAM_L_C_N: J8.2 ; port MIPI_CAM_B.MIPI_RX2_C_N
CAM_L_C_P: J8.3 ; port MIPI_CAM_B.MIPI_RX2_C_P
CAM_L_D0_N: J8.5 ; port MIPI_CAM_B.MIPI_RX2_D0_N
CAM_L_D0_P: J8.6 ; port MIPI_CAM_B.MIPI_RX2_D0_P
CAM_L_D1_N: J8.16 ; port MIPI_CAM_B.MIPI_RX2_D1_N
CAM_L_D1_P: J8.17 ; port MIPI_CAM_B.MIPI_RX2_D1_P
CAM_L_PWDN: J8.12 ; port CTL_CAM_B.CAM_B_PWDN_N  [project net CAM_B_PWDN_N]
CAM_R_C_N: J9.2 ; port MIPI_CAM_C.MIPI_RX3_C_N
CAM_R_C_P: J9.3 ; port MIPI_CAM_C.MIPI_RX3_C_P
CAM_R_D0_N: J9.5 ; port MIPI_CAM_C.MIPI_RX3_D0_N
CAM_R_D0_P: J9.6 ; port MIPI_CAM_C.MIPI_RX3_D0_P
CAM_R_D1_N: J9.16 ; port MIPI_CAM_C.MIPI_RX3_D1_N
CAM_R_D1_P: J9.17 ; port MIPI_CAM_C.MIPI_RX3_D1_P
CAM_R_PWDN: J9.12 ; port CTL_CAM_B.CAM_B_D_PWM  [project net CAM_B_D_PWM]
CAM_RST: J6.9 ; port CTL_CAM_A.CAM_A_PWDN_N  [project net CAM_A_PWDN_N]
COM_AUX_IO2: R2.1 ; port COM_AUX_IO2
FSIN1: J8.9 R10.2
FSIN2: J9.9 R12.2
I2C1_SCL: J6.6 ; port I2C1.I2C1_SCL
I2C1_SDA: J6.7 ; port I2C1.I2C1_SDA
I2C2_SCL: J8.11 J9.11 ; port I2C2.I2C2_SCL
I2C2_SDA: J8.10 J9.10 ; port I2C2.I2C2_SDA
MIPI_C_N: J6.18 ; port MIPI_CAM_A.MIPI_RX4_C_N
MIPI_C_P: J6.19 ; port MIPI_CAM_A.MIPI_RX4_C_P
MIPI_D0_N: J6.21 ; port MIPI_CAM_A.MIPI_RX4_D0_N
MIPI_D0_P: J6.22 ; port MIPI_CAM_A.MIPI_RX4_D0_P
MIPI_D1_N: J6.16 ; port MIPI_CAM_A.MIPI_RX4_D1_N
MIPI_D1_P: J6.15 ; port MIPI_CAM_A.MIPI_RX4_D1_P
MIPI_D2_N: J6.24 ; port MIPI_CAM_A.MIPI_RX5_D0_N
MIPI_D2_P: J6.25 ; port MIPI_CAM_A.MIPI_RX5_D0_P
MIPI_D3_N: J6.12 ; port MIPI_CAM_A.MIPI_RX5_D1_N
MIPI_D3_P: J6.13 ; port MIPI_CAM_A.MIPI_RX5_D1_P
STEREO_CLK: J8.14 J9.14 ; port CTL_CAM_B.CAM_B_CLK_OUT  [project net CAM_B_CLK_OUT]
STRB2: J9.8 TP1.1
STROBE1: J8.8 TP5.1
NetR2_2: R2.2 R10.1 R12.1

### Layout directives
differential pair: MIPI_C_N, MIPI_C_P, MIPI_D0_N, MIPI_D0_P, MIPI_D1_N, MIPI_D1_P, MIPI_D2_N, MIPI_D2_P, MIPI_D3_N, MIPI_D3_P

### Notes on the sheet
- STEREO CAMERA PAIR
- (near J8) STEREO LEFT
- (near J9) STEREO RIGHT
- RGB CAMERA
- MA2x8x Naming
- IMX378 Naming
- RGB
- IMX378
- MIPI Lanes:
- Max 2.1 Gbps / lane
- DPHYv1.2
- keep 100 ohm diff. Impedance on MIPI lanes
- (near J6) AUX_IO1/2 are not used on the BG0249, and on this design, their original source GPIO pins have been repurposed for a different output (SPI2).
- (near R2) (EXT STROBE)
- Title
- Size:
- Date:
- Tabloid
- Number:
- Time:
- Revision:
- Sheet
- of
- Drawn by:

### Library data of the parts
J6 = 54548-2671: CONN FFC BOTTOM 26POS 0.50MM R/A 26 Position FFC, FPC Connector Contacts, Bottom 0.020" (0.50mm) Surface Mount, Right Angle; Manufacturer_Name: Molex; Actuator Material: Polyphenylene; Current Rating: 500mA; Voltage Rating: 50V; Contact Resistance: 40mR; Number of Positions: 26; Wire/Cable Type: Straight; Pitch: 0.5mm; Datasheet Link: https://www.molex.com/molex/products/datasheet.jsp?part=active/0545482671_FFC_FPC_CONNECTORS.xml&channel=Products&Lang=en-US; Height: 1mm; Manufacturer_Part_Number: 54548-2671; Mouser Part Number: 538-54548-2671; Mouser Price/Stock: https://eu.mouser.com/ProductDetail/Molex/54548-2671?qs=sGAEpiMZZMs7i6cT6ogu49DbkzKdWzYdwOJCTNigfgU%3D; RoHS: Yes; Mount: Surface Mount; Contact Material: Bronze; Contact Plating: Gold; Housing Material: Polymer; Housing Color: Black; Min Operating Temperature: -20°C; Max Operating Temperature: 85°C; Number of Rows: 1; Package Quantity: 750; Packaging: Tape and Reel; Termination: Solder; Number of Contacts: 26; Orientation: Right Angle; Length: 18.2mm; Depth: 5mm; Flammability Rating: UL94 V-0; ComponentLink1URL: https://datasheet.ciiva.com/5137/0545482671-ffc-fpc-connectors-146697-5137857.pdf?src-supplier=Mouser; ComponentLink1Description: https://datasheet.ciiva.com/5137/0545482671-ffc-fpc-connectors-146697-5137857.pdf?src-supplier=Mouser; Supplier 1: Mouser; Manufacturer 1: Molex; Manufacturer Part Number 1: 54548-2671; Stock 1: 6344; Pricing 1: 1=3.03000, 10=2.86000, 25=2.55000, 100=2.42000, 250=2.12000, 500=2.07000 (USD); Supplier 2: Arrow; Manufacturer 2: Molex; Manufacturer Part Number 2: 54548-2671; Stock 2: 11173; Pricing 2: 1=3.50200, 10=3.34800, 25=3.06600, 100=2.78390, 250=2.43800, 500=2.41400, 1000=2.25990, 3000=2.10600, 6000=1.95200, 12000=1.73300, 24000=1.71600, 48000=1.69900, 60000=1.68200 (USD); Supplier Part Number 2: 0545482671; Supplier Part Number 1: 538-54548-2671
J8 J9 = 54548-2071: CONN FFC BOTTOM 20POS 0.50MM R/A 20 Position FFC, FPC Connector Contacts, Bottom 0.020" (0.50mm) Surface Mount, Right Angle; Manufacturer_Name: Molex; Actuator Material: Polyphenylene; Current Rating: 500mA; Voltage Rating: 50V; Contact Resistance: 40mR; Number of Positions: 20; Wire/Cable Type: Straight; Pitch: 0.02inch; Datasheet Link: http://www.molex.com/webdocs/datasheets/pdf/en-us//0545482271_FFC_FPC_CONNECTORS.pdf; Height: 1mm; Manufacturer_Part_Number: 54548-2071; Mouser Part Number: 538-54548-2071; Mouser Price/Stock: https://www.mouser.com/Search/Refine.aspx?Keyword=538-54548-2071; Supplier 1: Digi-Key; Manufacturer 1: Molex; Manufacturer Part Number 1: 54548-2071; Stock 1: 15609; Pricing 1: 1=2.57000, 10=2.33100, 25=2.18840, 50=2.09340, 100=1.99820, 250=1.80784 (USD); RoHS: Yes; Mount: Surface Mount; Contact Material: Bronze; Contact Plating: Gold; Housing Color: Black; Housing Material: Polymer; Min Operating Temperature: -20°C; Max Operating Temperature: 85°C; Number of Rows: 1; Termination: Solder; Orientation: Right Angle; Package Quantity: 750; Packaging: Tape and Reel; Mating Cycles: 20; Length: 15.2mm; Depth: 5mm; Radiation Hardening: No; Flammability Rating: UL94 V-0; ComponentLink1URL: https://datasheet.ciiva.com/15244/30580545482071-ffc-fpc-nectors-15244814.pdf?src-supplier=Arrow+Europe; ComponentLink1Description: https://datasheet.ciiva.com/15244/30580545482071-ffc-fpc-nectors-15244814.pdf?src-supplier=Arrow+Europe; Supplier 2: Mouser; Manufacturer 2: Molex; Manufacturer Part Number 2: 54548-2071; Stock 2: 4396; Pricing 2: 1=2.16000, 10=1.90000, 100=1.73000, 250=1.51000, 500=1.47000, 1000=1.25000, 3000=1.16000, 6000=1.12000 (USD); Supplier Part Number 1: WM8829CT-ND; Supplier Part Number 2: 538-54548-2071
R2 = RC0402FR-1310KL: as R31 on sheet BW1098FFC_USB; ComponentLink1URL: https://datasheet.ciiva.com/16940/pyu-rc0402-51-rohs-l-6-16940293.pdf?src-supplier=Avnet+Europe; ComponentLink1Description: https://datasheet.ciiva.com/16940/pyu-rc0402-51-rohs-l-6-16940293.pdf?src-supplier=Avnet+Europe; ComponentLink2URL: https://datasheet.ciiva.com/28386/pyu-rc0402-51-rohs-l-6-28386855.pdf?src-supplier=Avnet+Europe; ComponentLink2Description: https://datasheet.ciiva.com/28386/pyu-rc0402-51-rohs-l-6-28386855.pdf?src-supplier=Avnet+Europe; ComponentLink3URL: https://datasheet.ciiva.com/16740/pyu-rc0402-51-rohs-l-6-r-16740602.pdf?src-supplier=Future+Electronics; ComponentLink3Description: https://datasheet.ciiva.com/16740/pyu-rc0402-51-rohs-l-6-r-16740602.pdf?src-supplier=Future+Electronics; ComponentLink4URL: https://datasheet.ciiva.com/8891/pyu-rc0402-51-rohs-l-6-8891339.pdf?src-supplier=Avnet; ComponentLink4Description: https://datasheet.ciiva.com/8891/pyu-rc0402-51-rohs-l-6-8891339.pdf?src-supplier=Avnet; ComponentLink5URL: https://datasheet.ciiva.com/5557/pyu-rc0402-51-rohs-l-6-r-5557997.pdf?src-supplier=Mouser; ComponentLink5Description: https://datasheet.ciiva.com/5557/pyu-rc0402-51-rohs-l-6-r-5557997.pdf?src-supplier=Mouser; ComponentLink6URL: https://datasheet.ciiva.com/7983/1018594-7983533.pdf?src-supplier=Element14; ComponentLink6Description: https://datasheet.ciiva.com/7983/1018594-7983533.pdf?src-supplier=Element14; Supplier 1: Newark; Manufacturer Part Number 1: RC0402FR-1310KL; Stock 1: 62239; Pricing 1: 1=0.10000, 25=0.01200, 100=0.00400, 250=0.00400, 500=0.00300, 1000=0.00300 (USD); RoHS: Yes; Case/Package: 0402; Number of Pins: 2; Contact Plating: Tin,Matte,Lead; Case Code (Imperial): 0402; Case Code (Metric): 1005; Min Operating Temperature: -55°C; Max Operating Temperature: 155°C; Tolerance: 1%; Composition: Thick Film; Packaging: Tape and Reel; Termination: SMD/SMT; Military Standard: Not; Voltage Rating (DC): 50V; Working Voltage: 50V; Number of Terminations: 2; Length: 1mm; Depth: 0.5mm; Radiation Hardening: No; REACH SVHC: No SVHC; Lead Free: Lead Free; Supplier Part Number 1: 67R9960
R10 R12 = CRCW06030000Z0EA: RES SMD 0 OHM JUMPER 1/10W 0603 0 Ohms Jumper 0.1W, 1/10W Chip Resistor 0603 (1608 Metric) Automotive AEC-Q200 Thick Film; Manufacturer 1: Vishay; Manufacturer Part Number 1: CRCW0603-0000Z0EA; Resistance: 0mR; Power Rating: 100mW; Voltage Rating: 75V; Temperature Coefficient: 100ppm/°C; Tolerance: 5%; Current Rating: 2A; Supplier 1: Digi-Key; Stock 1: 742743; Pricing 1: 1=0.100000, 10=0.034000, 25=0.024400, 50=0.018600, 100=0.013800, 250=0.010480, 500=0.008400, 1000=0.006180 (USD); RoHS: Yes; Mount: Surface Mount; Case/Package: 0603; Weight: 7.1E-05oz; Contact Plating: Tin,Lead; Case Code (Metric): 1608; Case Code (Imperial): 0603; Min Operating Temperature: -55°C; Max Operating Temperature: 155°C; Composition: Thick Film; Termination: SMD/SMT; Packaging: Tape and Reel; Package Quantity: 1; Number of Terminations: 2; Military Standard: Not; Max Power Dissipation: 100mW; Voltage Rating (DC): 75V; Features: Automotive AEC-Q200; Working Voltage: 75V; Length: 1.55mm; Height: 0.02inch; Width: 0.033inch; Depth: 0.85mm; Radiation Hardening: No; Lead Free: Lead Free; REACH SVHC: Unknown; ComponentLink1URL: https://datasheet.ciiva.com/2461/dcrcwe3-2461968.pdf?src-supplier=Digi-Key; ComponentLink1Description: https://datasheet.ciiva.com/2461/dcrcwe3-2461968.pdf?src-supplier=Digi-Key; ComponentLink2URL: https://datasheet.ciiva.com/2461/dcrcwe3-2461969.pdf?src-supplier=Digi-Key; ComponentLink2Description: https://datasheet.ciiva.com/2461/dcrcwe3-2461969.pdf?src-supplier=Digi-Key; ComponentLink3URL: https://datasheet.ciiva.com/2461/dcrcwe3-2461970.pdf?src-supplier=Digi-Key; ComponentLink3Description: https://datasheet.ciiva.com/2461/dcrcwe3-2461970.pdf?src-supplier=Digi-Key; ComponentLink4URL: https://datasheet.ciiva.com/8340/dcrcwe3-8340197.pdf?src-supplier=Avnet; ComponentLink4Description: https://datasheet.ciiva.com/8340/dcrcwe3-8340197.pdf?src-supplier=Avnet; ComponentLink5URL: https://datasheet.ciiva.com/16941/dcrcw-16941302.pdf?src-supplier=Avnet+Europe; ComponentLink5Description: https://datasheet.ciiva.com/16941/dcrcw-16941302.pdf?src-supplier=Avnet+Europe; ComponentLink6URL: https://datasheet.ciiva.com/16199/dcrcwe3-16199063.pdf?src-supplier=Future+Electronics; ComponentLink6Description: https://datasheet.ciiva.com/16199/dcrcwe3-16199063.pdf?src-supplier=Future+Electronics; ComponentLink7URL: https://datasheet.ciiva.com/16725/70201119-16725175.pdf?src-supplier=Allied+Electronics; ComponentLink7Description: https://datasheet.ciiva.com/16725/70201119-16725175.pdf?src-supplier=Allied+Electronics; ComponentLink8URL: https://datasheet.ciiva.com/26316/fld-crcw-e3-data-en-26316615.pdf?src-supplier=Distrelec; ComponentLink8Description: https://datasheet.ciiva.com/26316/fld-crcw-e3-data-en-26316615.pdf?src-supplier=Distrelec; ComponentLink9URL: https://datasheet.ciiva.com/5544/dcrcwe3-109170-5544344.pdf?src-supplier=Mouser; ComponentLink9Description: https://datasheet.ciiva.com/5544/dcrcwe3-109170-5544344.pdf?src-supplier=Mouser; ComponentLink10URL: https://datasheet.ciiva.com/7841/1720486-7841816.pdf?src-supplier=Element14; ComponentLink10Description: https://datasheet.ciiva.com/7841/1720486-7841816.pdf?src-supplier=Element14; ComponentLink11URL: https://datasheet.ciiva.com/7841/1720486-7841817.pdf?src-supplier=Element14; ComponentLink11Description: https://datasheet.ciiva.com/7841/1720486-7841817.pdf?src-supplier=Element14; ComponentLink12URL: https://datasheet.ciiva.com/7841/125364-7841818.pdf?src-supplier=Element14; ComponentLink12Description: https://datasheet.ciiva.com/7841/125364-7841818.pdf?src-supplier=Element14; ComponentLink13URL: https://datasheet.ciiva.com/16721/70201119-16721450.pdf?src-supplier=Allied+Electronics; ComponentLink13Description: https://datasheet.ciiva.com/16721/70201119-16721450.pdf?src-supplier=Allied+Electronics; Supplier Part Number 1: 541-0.0GCT-ND
TP1 TP3-TP5 = TEST_POINT

## Sheet Project_Information.SchDoc: =project_title
size Tabloid; CompanyName: Luxonis Holding; DrawnBy: Brian Weinstein; Organization: Luxonis Holding; Address1: 1925 Harmony Park Drive; Address2: Westminster, CO; Address3: 80234; Address4: United States; DocumentNumber: D0000190; Revision: R2M1E2; SheetNumber: 1; SheetTotal: 5
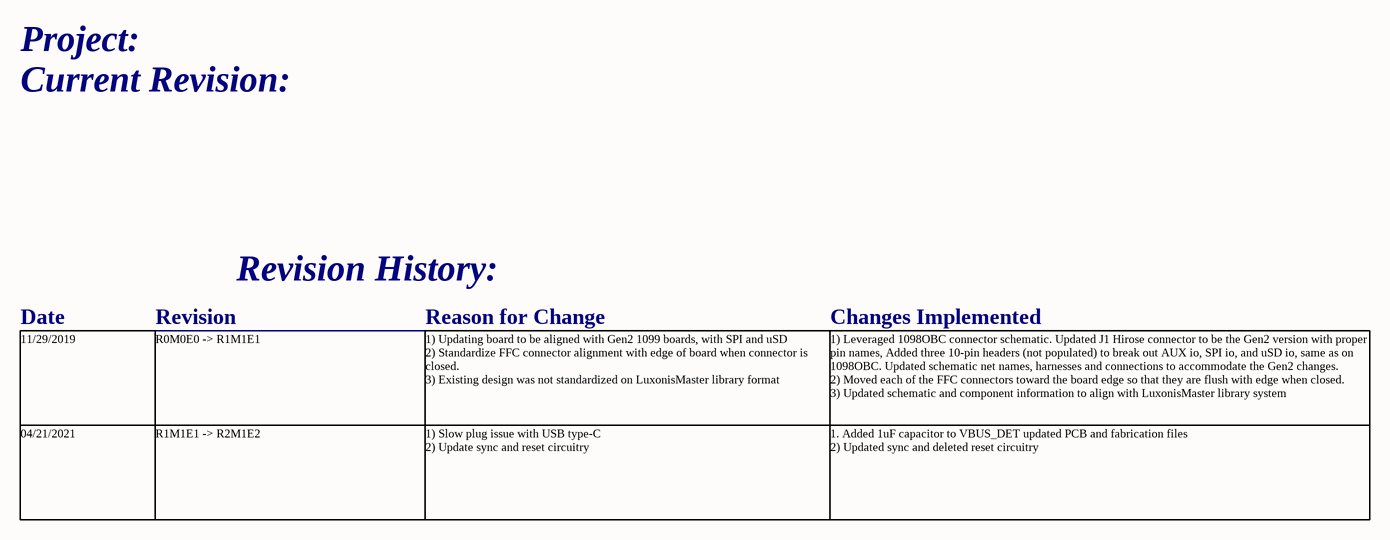
[diagram p4: Project_Information.SchDoc]

### Notes on the sheet
- Project:
- Current Revision:
- Revision History:
- Date
- Revision
- Reason for Change
- Changes Implemented
- 11/29/2019
- R0M0E0 -> R1M1E1
- 1) Updating board to be aligned with Gen2 1099 boards, with SPI and uSD
  2) Standardize FFC connector alignment with edge of board when connector is closed.
  3) Existing design was not standardized on LuxonisMaster library format
- 1) Leveraged 1098OBC connector schematic. Updated J1 Hirose connector to be the Gen2 version with proper pin names, Added three 10-pin headers (not populated) to break out AUX io, SPI io, and uSD io, same as on 1098OBC. Updated schematic net names, harnesses and connections to accommodate the Gen2 changes.
  2) Moved each of the FFC connectors toward the board edge so that they are flush with edge when closed.
  3) Updated schematic and component information to align with LuxonisMaster library system
- 04/21/2021
- R1M1E1 -> R2M1E2
- 1) Slow plug issue with USB type-C
  2) Update sync and reset circuitry
- 1. Added 1uF capacitor to VBUS_DET updated PCB and fabrication files
  2) Updated sync and deleted reset circuitry
- Title
- Size:
- Date:
- Tabloid
- Number:
- Time:
- Revision:
- Sheet
- of
- Drawn by:

## Nets that join several sheets
3.3VIN: BW1098FFC_TopLevel (C1.2 TP33.1 U1.1), BW1098FFC_USB (C74.2 R186.2 U61.6)
GND: BW1098FFC_TopLevel (20 pins), BW1098FFC_Connector (41 pins), BW1098FFC_USB (22 pins), BW1098FFC_MIPI_CAM (26 pins)
VBUS: BW1098FFC_Connector (J1.53), BW1098FFC_USB (10 pins)
VDD_5V: BW1098FFC_TopLevel (11 pins), BW1098FFC_Connector (8 pins), BW1098FFC_USB (C76.2 R213.2 R214.2 U62.12), BW1098FFC_MIPI_CAM (6 pins)
2485_PGOOD: BW1098FFC_TopLevel (M3.1), BW1098FFC_Connector (J1.37 J4.5)
CAM_A_CLK_OUT: BW1098FFC_Connector (J1.28), BW1098FFC_MIPI_CAM (J6.10)
CAM_A_PWDN_N: BW1098FFC_Connector (J1.34), BW1098FFC_MIPI_CAM (J6.9)
CAM_B_CLK_OUT: BW1098FFC_Connector (J1.73), BW1098FFC_MIPI_CAM (J8.14 J9.14)
CAM_B_D_PWM: BW1098FFC_Connector (J1.65), BW1098FFC_MIPI_CAM (J9.12)
CAM_B_PWDN_N: BW1098FFC_Connector (J1.67), BW1098FFC_MIPI_CAM (J8.12)
CAM_L_C_N: BW1098FFC_Connector (J1.95), BW1098FFC_MIPI_CAM (J8.2)
CAM_L_C_P: BW1098FFC_Connector (J1.97), BW1098FFC_MIPI_CAM (J8.3)
CAM_L_D0_N: BW1098FFC_Connector (J1.89), BW1098FFC_MIPI_CAM (J8.5)
CAM_L_D0_P: BW1098FFC_Connector (J1.91), BW1098FFC_MIPI_CAM (J8.6)
CAM_L_D1_N: BW1098FFC_Connector (J1.83), BW1098FFC_MIPI_CAM (J8.16)
CAM_L_D1_P: BW1098FFC_Connector (J1.85), BW1098FFC_MIPI_CAM (J8.17)
CAM_R_C_N: BW1098FFC_Connector (J1.96), BW1098FFC_MIPI_CAM (J9.2)
CAM_R_C_P: BW1098FFC_Connector (J1.98), BW1098FFC_MIPI_CAM (J9.3)
CAM_R_D0_N: BW1098FFC_Connector (J1.90), BW1098FFC_MIPI_CAM (J9.5)
CAM_R_D0_P: BW1098FFC_Connector (J1.92), BW1098FFC_MIPI_CAM (J9.6)
CAM_R_D1_N: BW1098FFC_Connector (J1.84), BW1098FFC_MIPI_CAM (J9.16)
CAM_R_D1_P: BW1098FFC_Connector (J1.86), BW1098FFC_MIPI_CAM (J9.17)
COM_AUX_IO2: BW1098FFC_Connector (J1.42 TP2.1), BW1098FFC_MIPI_CAM (R2.1)
I2C1_SCL: BW1098FFC_Connector (J1.35), BW1098FFC_MIPI_CAM (J6.6)
I2C1_SDA: BW1098FFC_Connector (J1.33), BW1098FFC_MIPI_CAM (J6.7)
I2C2_SCL: BW1098FFC_Connector (J1.77), BW1098FFC_MIPI_CAM (J8.11 J9.11)
I2C2_SDA: BW1098FFC_Connector (J1.79), BW1098FFC_MIPI_CAM (J8.10 J9.10)
MIPI_C_N: BW1098FFC_Connector (J1.3), BW1098FFC_MIPI_CAM (J6.18)
MIPI_C_P: BW1098FFC_Connector (J1.5), BW1098FFC_MIPI_CAM (J6.19)
MIPI_D0_N: BW1098FFC_Connector (J1.9), BW1098FFC_MIPI_CAM (J6.21)
MIPI_D0_P: BW1098FFC_Connector (J1.11), BW1098FFC_MIPI_CAM (J6.22)
MIPI_D1_N: BW1098FFC_Connector (J1.15), BW1098FFC_MIPI_CAM (J6.16)
MIPI_D1_P: BW1098FFC_Connector (J1.17), BW1098FFC_MIPI_CAM (J6.15)
MIPI_D2_N: BW1098FFC_Connector (J1.21), BW1098FFC_MIPI_CAM (J6.24)
MIPI_D2_P: BW1098FFC_Connector (J1.23), BW1098FFC_MIPI_CAM (J6.25)
MIPI_D3_N: BW1098FFC_Connector (J1.27), BW1098FFC_MIPI_CAM (J6.12)
MIPI_D3_P: BW1098FFC_Connector (J1.29), BW1098FFC_MIPI_CAM (J6.13)
MODULE_nRST: BW1098FFC_TopLevel (M1.1), BW1098FFC_Connector (B1.2 J1.39 J4.1)
USB_D_N: BW1098FFC_Connector (J1.18), BW1098FFC_USB (J14.A7 J14.B7)
USB_D_P: BW1098FFC_Connector (J1.16), BW1098FFC_USB (J14.A6 J14.B6)
USB_RX_N: BW1098FFC_Connector (J1.12), BW1098FFC_USB (U61.4)
USB_RX_P: BW1098FFC_Connector (J1.10), BW1098FFC_USB (U61.3)
USB_TX_N: BW1098FFC_Connector (J1.24), BW1098FFC_USB (U61.8)
USB_TX_P: BW1098FFC_Connector (J1.22), BW1098FFC_USB (U61.7)

## Assembly variants
Production: not fitted J3 J4 J5 RZ28 RZ29